# EAGLE design Raspberry_pi_b_swim (EAGLE 6.5.0)
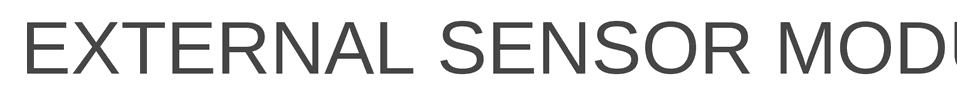
[diagram p0: schematic, sheet 1, part 1 of 2]
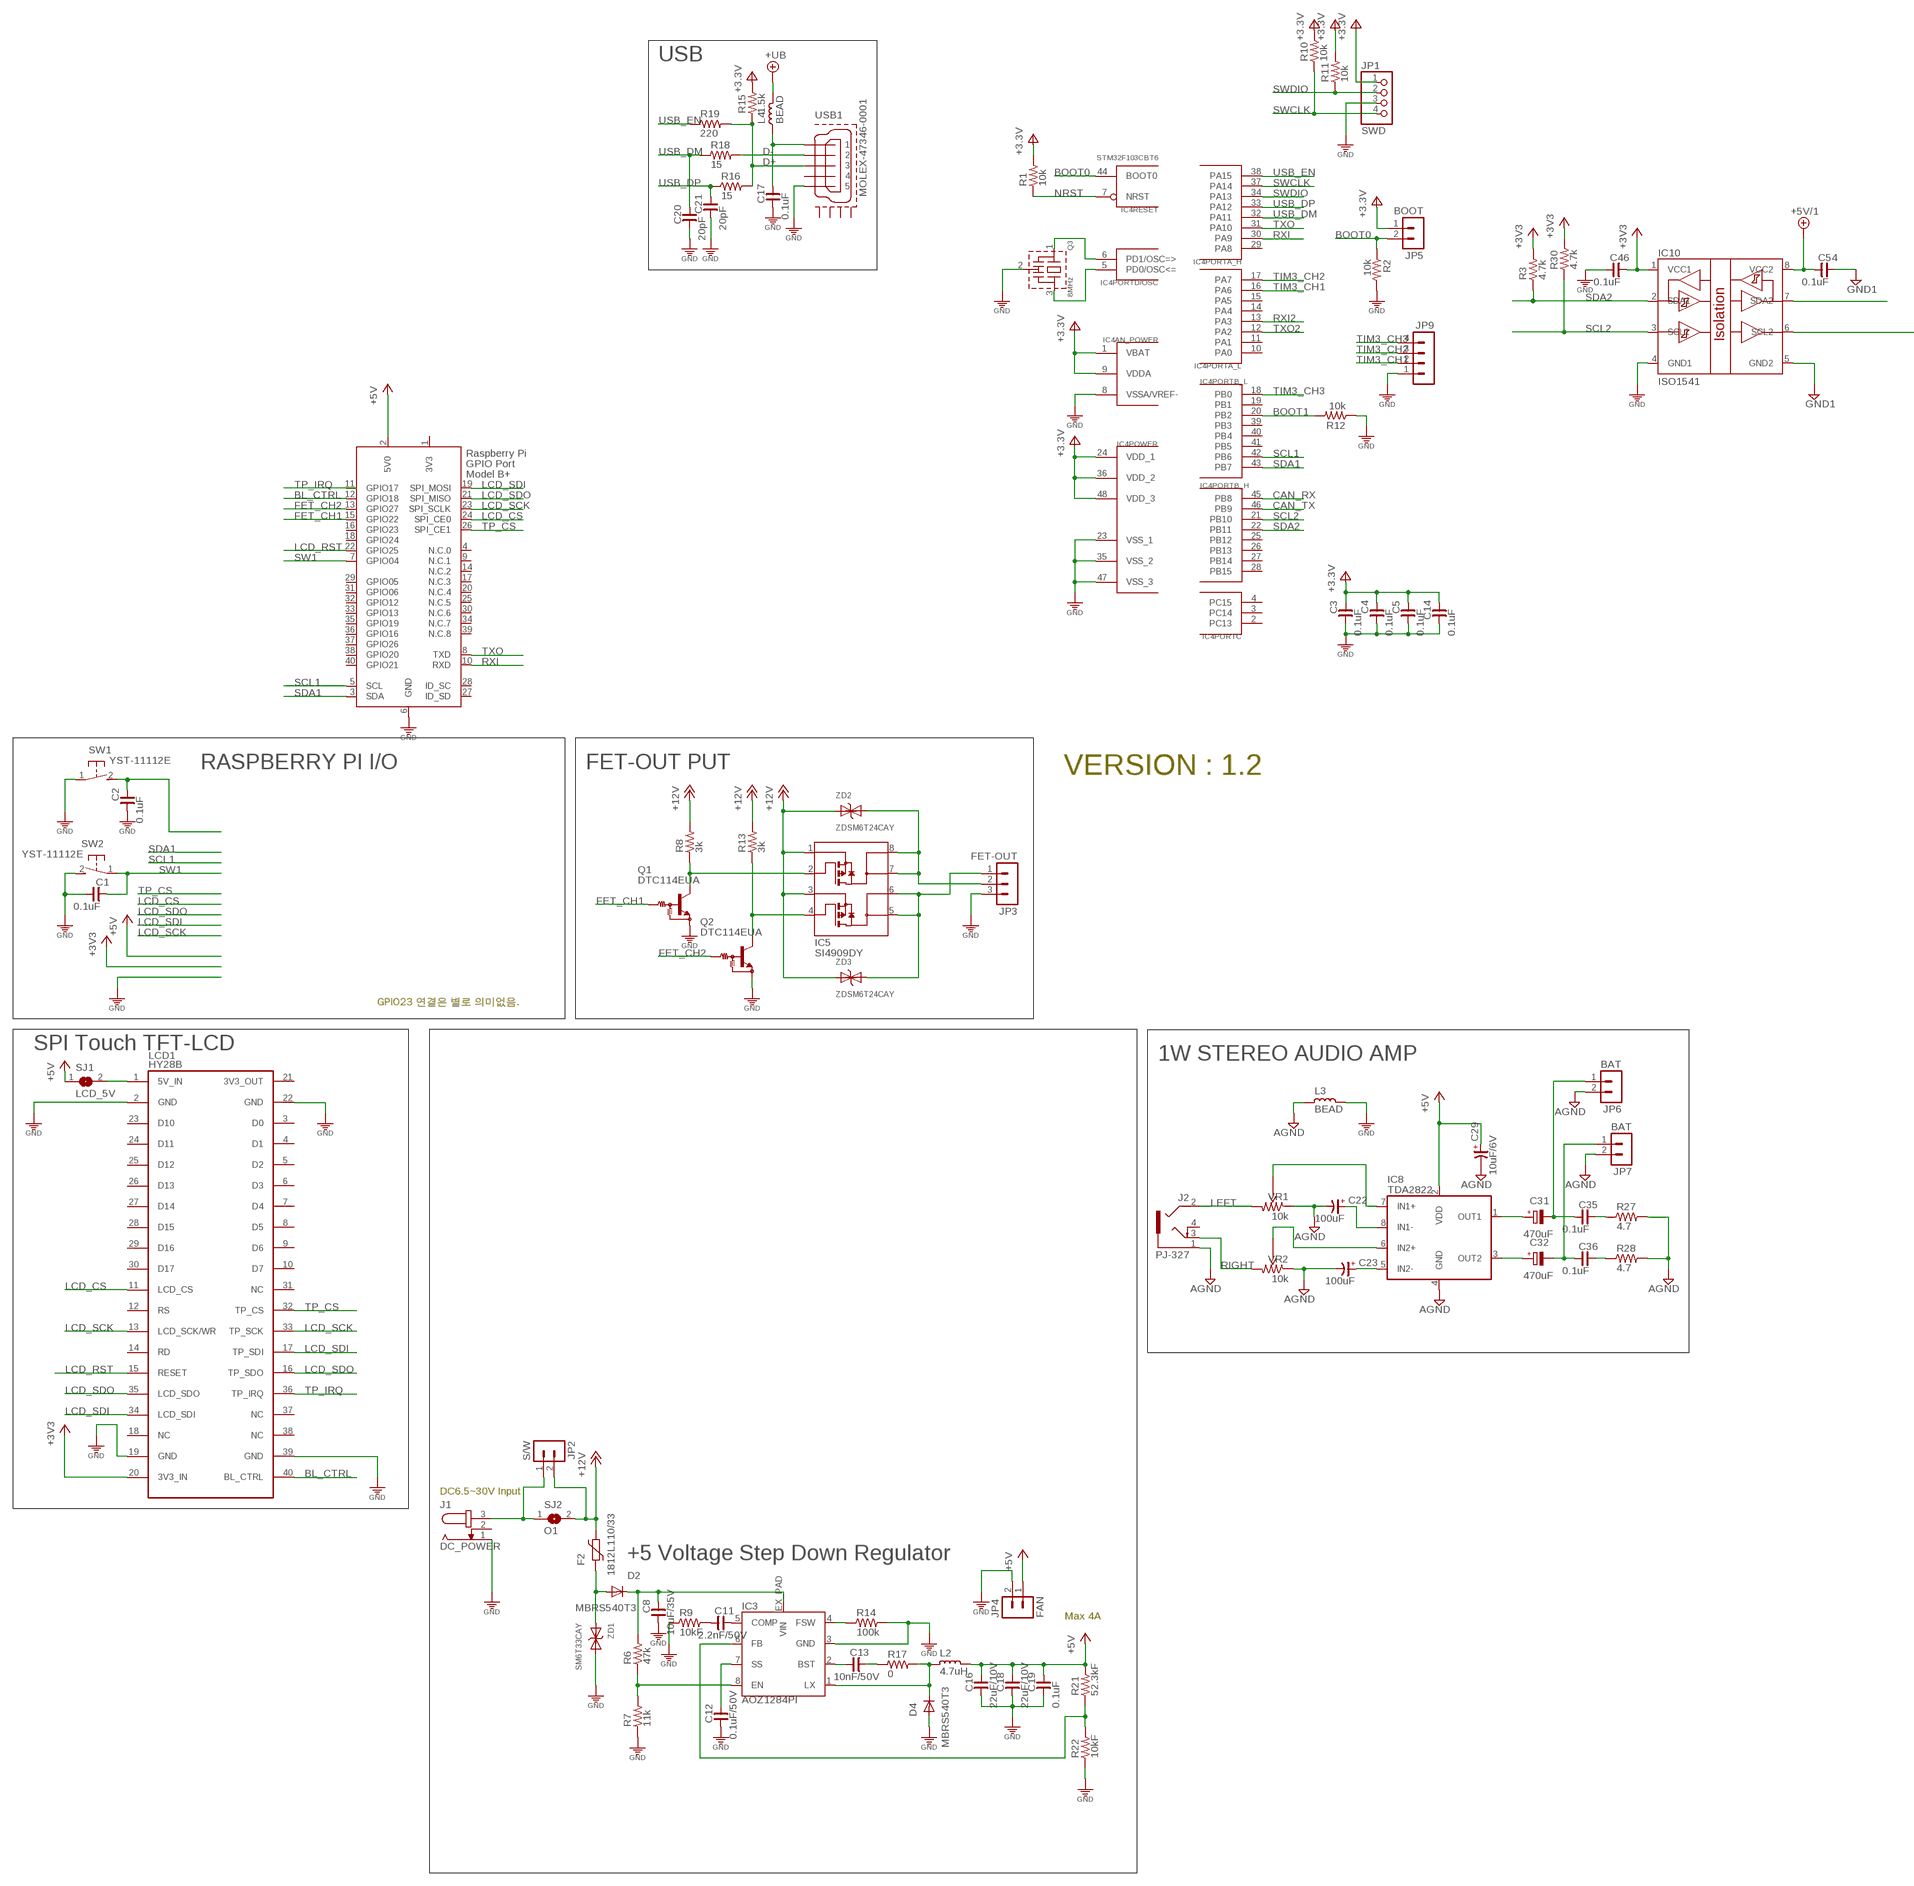
[diagram p1: schematic, sheet 1, part 2 of 2]

## Parts
C1  0.1uF  C_0603  [C0603]
C2  0.1uF  C_0603  [C0603]
C3  0.1uF  C_0603  [C0603]
C4  0.1uF  C_0603  [C0603]
C5  0.1uF  C_0603  [C0603]
C8  10uF/35V  C_3225  [C3225]
C11  2.2nF/50V  C_0603  [C0603]
C12  0.1uF/50V  C_0603  [C0603]
C13  10nF/50V  C_0603  [C0603]
C14  0.1uF  C_0603  [C0603]
C16  22uF/10V  C_3216  [C3216]
C17  0.1uF  C_0603  [C0603]
C18  22uF/10V  C_3216  [C3216]
C19  0.1uF  C_0603  [C0603]
C20  20pF  C_0603  [C0603]
C21  20pF  C_0603  [C0603]
C22  100uF  CP_3528-21  [C3528-21/T]
C23  100uF  CP_3528-21  [C3528-21/T]
C29  10uF/6V  CP_3216-18  [C3216-18/T]
C31  470uF  CPOL-EUD/7343-31W  [D/7343-31W]
C32  470uF  CPOL-EUD/7343-31W  [D/7343-31W]
C35  0.1uF  C_0603  [C0603]
C36  0.1uF  C_0603  [C0603]
C46  0.1uF  C_0603  [C0603]
C54  0.1uF  C_0603  [C0603]
D2  MBRS540T3  DIODE-SMC  [SMC]
D4  MBRS540T3  DIODE-SMC  [SMC]
F2  1812L110/33  1812L  [1812L]
IC3  AOZ1284PI  [S08-EP1]
IC4  STM32F103CBT6  STM32F10XCXT6  [TQFP48]
IC5  SI4909DY  P-CH_DUALSO-8  [SO08-1]
IC8  TDA2822  [SO08]
IC10  ISO1541  [SO08]
J1  DC_POWER  JACK-PLUG0  [SPC4077]
J2  PJ-327  AUDIO_JACK2  [PJ-327-2]
JP1  SWD  PINHD-1X4M  [1X04M]
JP2  S/W  MA02MOL-R  [MA02-MOL-R]
JP3  FET-OUT  MA03-1DEF  [MA03]
JP4  FAN  MA02MOL-R  [MA02-MOL-R]
JP5  BOOT  MA02SMD  [MA02-1-MOL]
JP6  BAT  MA02MOL-R  [MA02-MOL-R]
JP7  BAT  MA02MOL-R  [MA02-MOL-R]
JP9  MA04-15267  [MOLEX5267-04]
L2  4.7uH  L_4545  [L4545]
L3  BEAD  L_0603  [L0603]
L4  BEAD  L_0805  [L0805]
LCD1  HY28B  [HY28A]
Q1  DTC114EUA  [SC59-BEC]
Q2  DTC114EUA  [SC59-BEC]
Q3  8MHz  X-TAL-SMALLRESONATOR  [CSTLA_X]
R1  10k  R_0603  [R0603]
R2  10k  R_0603  [R0603]
R3  4.7k  R_0603  [R0603]
R6  47k  R_0603  [R0603]
R7  11k  R_0603  [R0603]
R8  3k  R_0603  [R0603]
R9  10kF  R_0603  [R0603]
R10  10k  R_0603  [R0603]
R11  10k  R_0603  [R0603]
R12  10k  R_0603  [R0603]
R13  3k  R_0603  [R0603]
R14  100k  R_0603  [R0603]
R15  1.5k  R_0603  [R0603]
R16  15  R_0603  [R0603]
R17  0  R_0603  [R0603]
R18  15  R_0603  [R0603]
R19  220  R_0603  [R0603]
R21  52.3kF  R_0603  [R0603]
R22  10kF  R_0603  [R0603]
R27  4.7  R_0603  [R0603]
R28  4.7  R_0603  [R0603]
R30  4.7k  R_0603  [R0603]
SJ1  LCD_5V  SJ  [SJ]
SJ2  O1  SJ  [SJ]
SW1  YST-11112E  [YST-1112E]
SW2  YST-11112E  [YST-1112E]
USB1  MOLEX-47346-0001  [MOLEX-47364-0001]
VR1  10k  R-TRIMMER-SMD3313  [R-TRIMMER-3313J]
VR2  10k  R-TRIMMER-SMD3313  [R-TRIMMER-3313J]
X1  RASPI_BOARD_B+_F  [RASPI_BOARD_B+_FULL]
ZD1  SM6T33CAY  ZDSM6T33CAY  [SMB]
ZD2  ZDSM6T24CAY  ZDSM6T33CAY  [SMB]
ZD3  ZDSM6T24CAY  ZDSM6T33CAY  [SMB]

## Nets
3V3: C3.1 C4.1 C5.1 C14.1 IC4.1(AN_POWER:VBAT) IC4.9(AN_POWER:VDDA) IC4.24(POWER:VDD_1) IC4.36(POWER:VDD_2) IC4.48(POWER:VDD_3) JP1.1 JP5.1 R1.2 R10.2 R11.2 R15.2 ; supply symbol labelled +3V3
+3V3: C46.1 IC10.1(VCC1) LCD1.20(3V3_IN) R3.2 R30.2
+5V: C16.1 C18.1 C19.1 C29.+ IC8.2(VDD) JP4.1 L2.1 R21.2 SJ1.1 X1.2(5V0)
+5V/1: C54.2 IC10.8(VCC2)
+12V: F2.P$2 IC5.1 IC5.3 JP2.2 R8.2 R13.2 SJ2.2 ZD2.A ZD3.A
+UB: L4.1
AGND: C22.- C23.- C29.- IC8.4(GND) J2.1 JP6.2 JP7.2 L3.2 R27.2 R28.2 VR1.1 VR2.1
BL_CTRL: LCD1.40(BL_CTRL) X1.12(GPIO18)
BOOT0: IC4.44(RESET:BOOT0) JP5.2 R2.1
BOOT1: IC4.20(PORTB_L:PB2) R12.2
CAN_RX: IC4.45(PORTB_H:PB8)
CAN_TX: IC4.46(PORTB_H:PB9)
D+: R15.1 R16.2 R19.2 USB1.3
D-: R18.2 USB1.2
DC-IN: D2.A F2.P$1 ZD1.A
FET_CH1: Q1.2(IN) X1.15(GPIO22)
FET_CH2: Q2.2(IN) X1.13(GPIO27)
GND [GND]: C1.2 C2.2 C3.2 C4.2 C5.2 C8.2 C12.2 C14.2 C16.2 C17.2 C18.2 C19.2 C20.2 C21.2 C46.2 D4.A IC3.3(GND) IC4.8(AN_POWER:VSSA/VREF-) IC4.23(POWER:VSS_1) IC4.35(POWER:VSS_2) IC4.47(POWER:VSS_3) IC10.4(GND1) J1.1 JP1.3 JP3.3 JP4.2 JP9.1 L3.1 LCD1.2(GND) Q1.1(GND) Q2.1(GND) Q3.2(GND) R2.2 R7.1 R9.1 R12.1 R14.2 R22.1 SW1.1 SW2.2 USB1.5 X1.6(GND) ZD1.C(K)
GND1 [GND]: C54.1 IC10.5(GND2)
GND@1 [GND]: LCD1.19(GND) ; supply symbol labelled GND
GND@2 [GND]: LCD1.22(GND) ; supply symbol labelled GND
GND@3 [GND]: LCD1.39(GND) ; supply symbol labelled GND
LCD_CS: LCD1.11(LCD_CS) X1.24(SPI_CE0)
LCD_RST: LCD1.15(RESET) X1.22(GPIO25)
LCD_SCK: LCD1.13(LCD_SCK/WR) LCD1.33(TP_SCK) X1.23(SPI_SCLK)
LCD_SDI: LCD1.17(TP_SDI) LCD1.34(LCD_SDI) X1.19(SPI_MOSI)
LCD_SDO: LCD1.16(TP_SDO) LCD1.35(LCD_SDO) X1.21(SPI_MISO)
LEFT: J2.2 VR1.3
N$1: IC4.6(PORTD/OSC:PD1/OSC=>) Q3.1(IN)
N$2: C8.1 D2.C IC3.EX_PAD(VIN) R6.2
N$3: IC3.6(FB) R21.1 R22.2
N$4: C13.2 IC3.2(BST)
N$5: J1.3 JP2.1 SJ2.1
N$7: IC4.5(PORTD/OSC:PD0/OSC<=) Q3.3(OUT)
N$8: C13.1 R17.1
N$9: D4.C IC3.1(LX) L2.2 R17.2
N$10: C11.1 IC3.5(COMP)
N$11: C11.2 R9.2
N$13: C2.1 SW1.2
N$19: IC3.8(EN) R6.1 R7.2
N$20: IC5.2 Q1.3(OUT) R8.1
N$21: IC3.4(FSW) R14.1
N$22: C17.1 L4.2 USB1.1
N$24: C12.1 IC3.7(SS)
N$31: IC5.4 Q2.3(OUT) R13.1
N$32: LCD1.1(5V_IN) SJ1.2
N$36: C22.+ IC8.8(IN1-)
N$37: C23.+ IC8.5(IN2-)
N$39: IC8.6(IN2+) VR2.2
N$41: IC8.7(IN1+) VR1.2
N$42: C31.+ IC8.1(OUT1)
N$43: C32.+ IC8.3(OUT2)
N$44: C31.- C35.2 JP6.1
N$45: C32.- C36.2 JP7.1
N$46: C35.1 R27.1
N$47: C36.1 R28.1
NRST: IC4.7(RESET:NRST) R1.1
RELAY1: IC5.5 IC5.6 JP3.1 ZD3.C(K)
RELAY2: IC5.7 IC5.8 JP3.2 ZD2.C(K)
RIGHT: J2.3 VR2.3
RXI: IC4.30(PORTA_H:PA9) X1.10(RXD)
RXI2: IC4.13(PORTA_L:PA3)
SCL1: IC4.42(PORTB_L:PB6) X1.5(SCL)
SCL2: IC4.21(PORTB_H:PB10) IC10.3(SCL1) R30.1
SCL2-2: IC10.6(SCL2)
SDA1: IC4.43(PORTB_L:PB7) X1.3(SDA)
SDA2: IC4.22(PORTB_H:PB11) IC10.2(SDA1) R3.1
SDA2-2: IC10.7(SDA2)
SW1: C1.1 SW2.1 X1.7(GPIO04)
SWCLK: IC4.37(PORTA_H:PA14) JP1.4 R10.1
SWDIO: IC4.34(PORTA_H:PA13) JP1.2 R11.1
TIM3_CH1: IC4.16(PORTA_L:PA6) JP9.2
TIM3_CH2: IC4.17(PORTA_L:PA7) JP9.3
TIM3_CH3: IC4.18(PORTB_L:PB0) JP9.4
TP_CS: LCD1.32(TP_CS) X1.26(SPI_CE1)
TP_IRQ: LCD1.36(TP_IRQ)
TXO: IC4.31(PORTA_H:PA10) X1.8(TXD)
TXO2: IC4.12(PORTA_L:PA2)
USB_DM: C20.1 IC4.32(PORTA_H:PA11) R18.1
USB_DP: C21.1 IC4.33(PORTA_H:PA12) R16.1
USB_EN: IC4.38(PORTA_H:PA15) R19.1
Unconnected: IC4.2(PORTC:PC13) IC4.3(PORTC:PC14) IC4.4(PORTC:PC15) IC4.10(PORTA_L:PA0) IC4.11(PORTA_L:PA1) IC4.14(PORTA_L:PA4) IC4.15(PORTA_L:PA5) IC4.19(PORTB_L:PB1) IC4.25(PORTB_H:PB12) IC4.26(PORTB_H:PB13) IC4.27(PORTB_H:PB14) IC4.28(PORTB_H:PB15) IC4.29(PORTA_H:PA8) IC4.39(PORTB_L:PB3) IC4.40(PORTB_L:PB4) IC4.41(PORTB_L:PB5) J1.2 J2.4 LCD1.3(D0) LCD1.4(D1) LCD1.5(D2) LCD1.6(D3) LCD1.7(D4) LCD1.8(D5) LCD1.9(D6) LCD1.10(D7) LCD1.12(RS) LCD1.14(RD) LCD1.18(NC) LCD1.21(3V3_OUT) LCD1.23(D10) LCD1.24(D11) LCD1.25(D12) LCD1.26(D13) LCD1.27(D14) LCD1.28(D15) LCD1.29(D16) LCD1.30(D17) LCD1.31(NC) LCD1.37(NC) LCD1.38(NC) USB1.4 USB1.GND1 USB1.GND2 USB1.GND3 USB1.GND4 X1.4(N.C.0) X1.9(N.C.1) X1.11(GPIO17) X1.14(N.C.2) X1.16(GPIO23) X1.17(N.C.3) X1.18(GPIO24) X1.20(N.C.4) X1.25(N.C.5) X1.27(ID_SD) X1.28(ID_SC) X1.29(GPIO05) X1.30(N.C.6) X1.31(GPIO06) X1.32(GPIO12) X1.33(GPIO13) X1.34(N.C.7) X1.35(GPIO19) X1.36(GPIO16) X1.37(GPIO26) X1.38(GPIO20) X1.39(N.C.8) X1.40(GPIO21)

## Notes on the sheet
- EXTERNAL SENSOR MODULE
- USB
- RASPBERRY PI I/O | FET-OUT PUT | VERSION : 1.2
- GPIO23 연결은 별로 의미없음.
- SPI Touch TFT-LCD
- 1W STEREO AUDIO AMP
- DC6.5~30V Input
- +5 Voltage Step Down Regulator
- Max 4A

## Power pins joined to a net without a drawn wire
3V3: X1.1(3V3)

## Library data of the parts
C1-C5 C8 C11-C14 C16-C21 C35 C36 C46 C54 = cona_lib:C_: NON-POLARIZED CAP
C22 C23 C29 = rc-master-smd:CP_: POLARIZED CAP
C31 C32 = cona_lib:CPOL-EU: POLARIZED CAPACITOR, European symbol
D2 D4 = diode:DIODE-: DIODE
F2 = ptc-littlefuse:1812L
IC3 = cona_lib:AOZ1284PI
IC4 = stm32:STM32F10XCXT6: ST STM32F101/103 48pin LQFP
IC5 = cona_lib:P-CH_DUAL
IC8 = cona_lib:TDA2822
IC10 = cona_lib:ISO1541
J1 = con-jack:JACK-PLUG: DC POWER JACK Power Jack, DC, Right Angle, Through Hole, Rated 5A at 16VDC, PC Terminals Distributor: Farnell (www.Farnell.de) Drawing: 84N1161.pdf / 84N1162.pdf Manufacturer: SPC Technology (www.spctechnology.com) Type: SPC4077 / SPC 4078
J2 = cona_lib:AUDIO_JACK2
JP1 = pinhead:PINHD-1X4: PIN HEADER
JP2 JP4-JP7 = cona_lib:MA02
JP3 = cona_lib:MA03-1: PIN HEADER
JP9 = cona_lib:MA04-1: PIN HEADER
L2-L4 = cona_lib:L_: INDUCTOR
LCD1 = TFT-LCD:HY28B
Q1 Q2 = cona_lib:DTC114EUA: NPN Bias Resistor Transistor
Q3 = cona_lib:X-TAL-SMALL: Ceramic Resonators MuRata CSTCE08MOOG52A
R1-R3 R6-R19 R21 R22 R27 R28 R30 = cona_lib:R_: RESISTOR
SJ1 SJ2 = cona_lib:SJ: SMD solder JUMPER
SW1 SW2 = switch-tact:YST-11112E
USB1 = usb_con-update:MOLEX-47346-0001: MICRO USB B, BOTTOM MOUNT
VR1 VR2 = cona_lib:R-TRIMMER-SMD: SMD R-TRIMMER
X1 = raspberrypi_bastelstube_v13:RASPI_BOARD_B+: Raspberry Pi GPIO connector with markings for the outer dimensions of the Raspberry Pi board model B+ with different sets of drill holes or mounting pads
ZD1-ZD3 = GRU-EURO6:ZD

## Net classes
0 default: clearance 0.152 mm
1 power: width 0.152 mm
2 GND: width 0.2 mm, clearance 0.152 mm

## Board
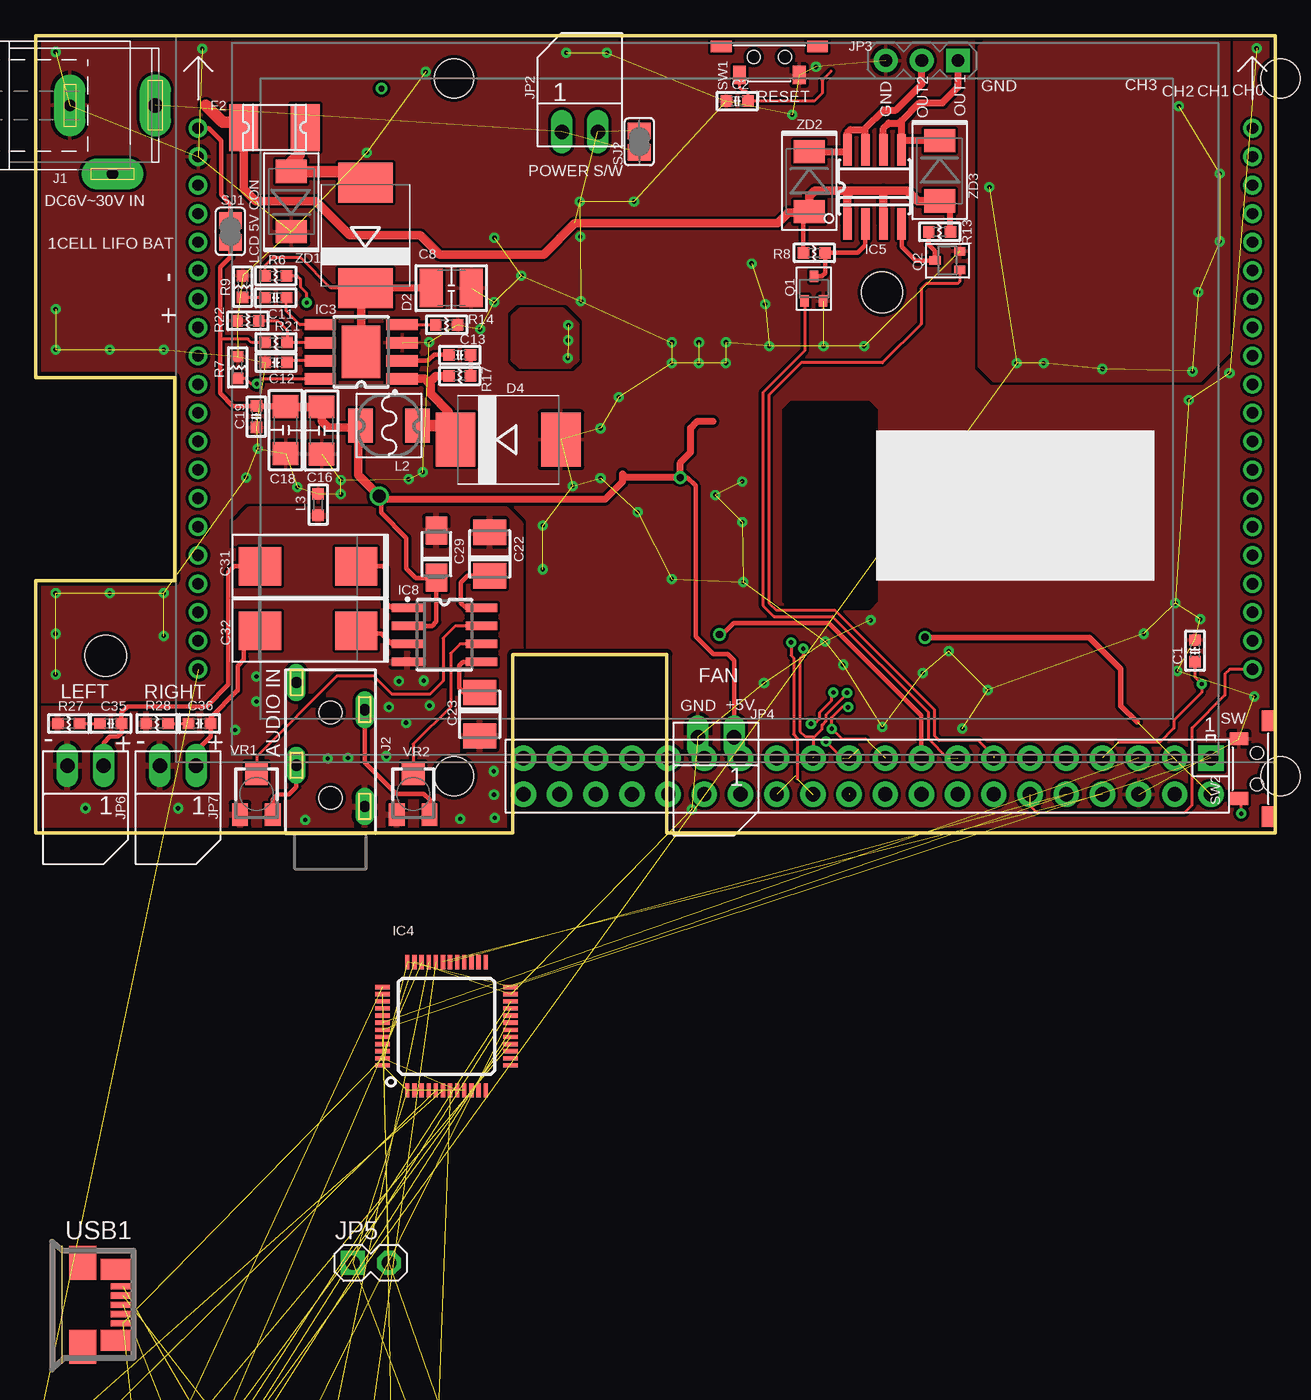
[diagram p2: board, top side]
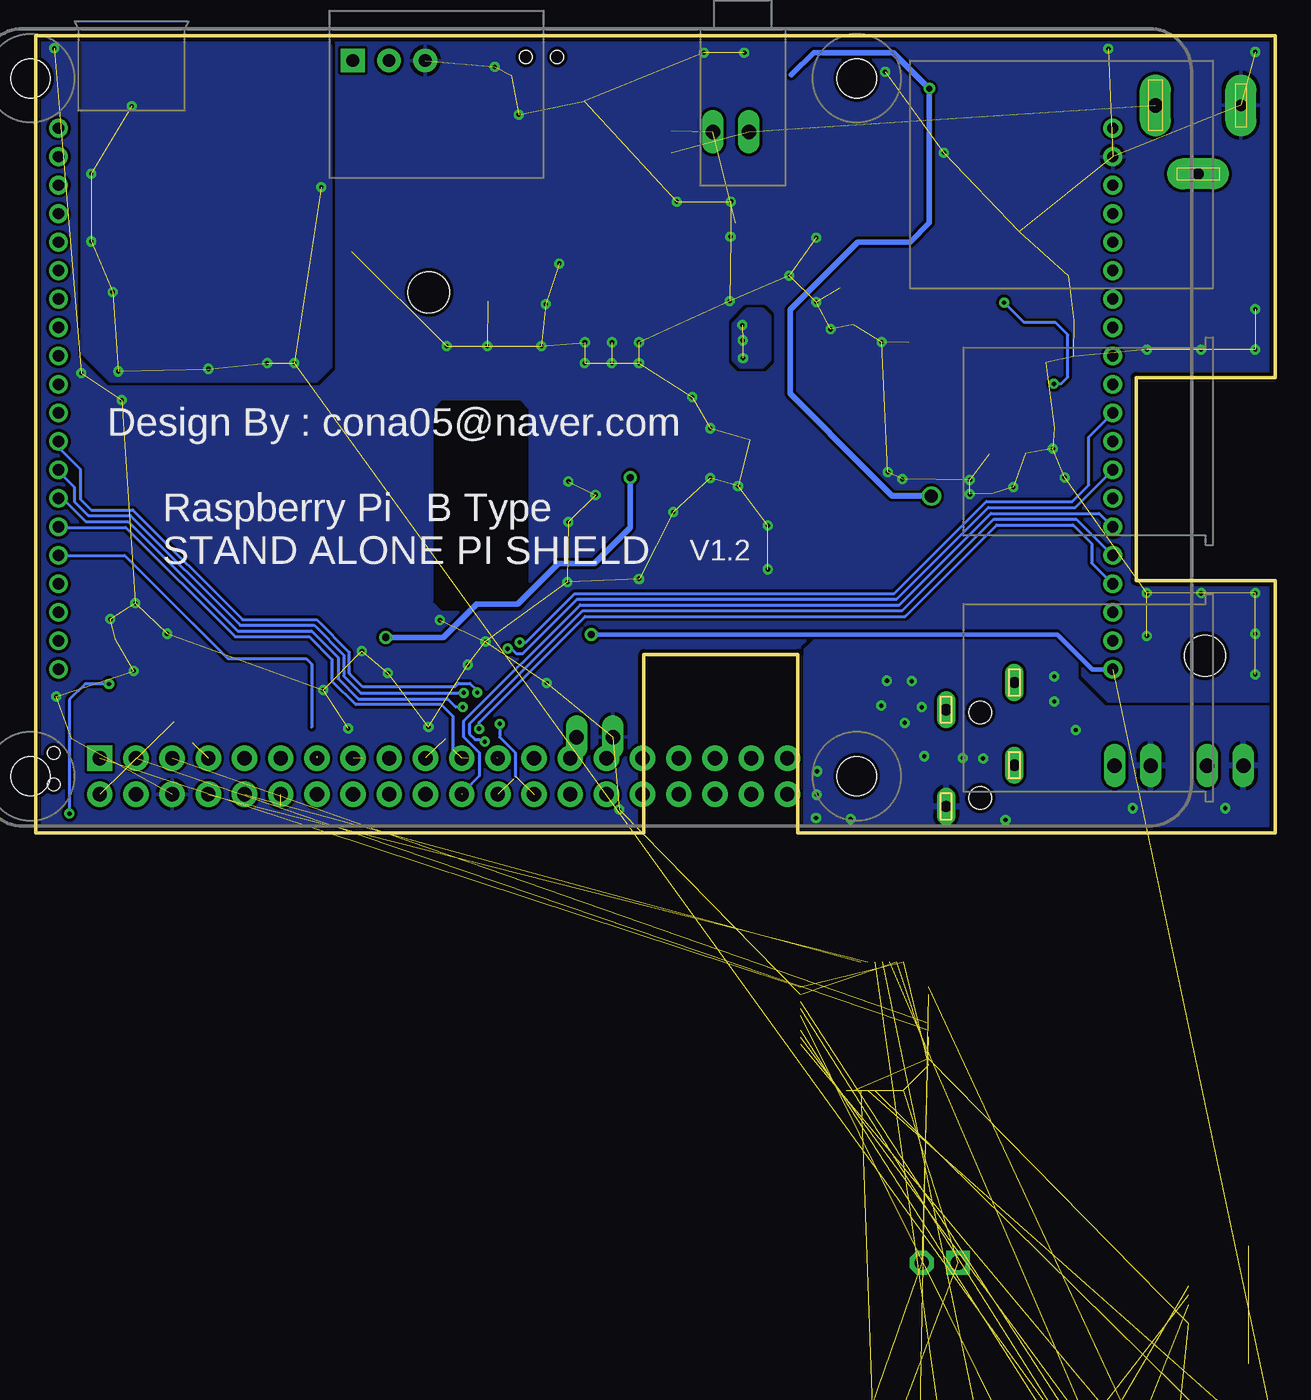
[diagram p3: board, bottom side, seen from below]

Size 87 x 56 mm. Coordinates in mm from the lower left corner, seen from the top.
Outline: 87,56 0,56 0,32 9.75,32 9.75,17.75 0,17.75 0,0 33.5,0 33.5,12.55 44.3,12.55 44.3,0 87,0 87,56
Copper layers (1*16): Top 0.035mm / dielectric 1.5mm / Bottom 0.035mm
Design rules "KHC_mm": minimum track width 0.2mm, minimum drill 0.3mm, track to track 0.2mm, track to pad 0.2mm, pad to pad 0.2mm, via to via 0.2mm, smd to smd 0.2mm, copper to edge 10mil, drill to drill 0.2mm, minimum pad ring 10mil, minimum via ring 8mil, stop-mask expansion 4mil, vias tented up to drill 0mil, thermal gap 10mil
Holes 2.9 mm at 59.4,37.98 4.92,12.45

### Footprints (pad centres in the part's own frame; a part is rotated, then mirrored left to right if it is on the bottom)
C0603 = smd 0.8 x 0.8: 1 -0.762,0; 2 0.762,0
C3225 = smd 1.6 x 2.7: 1 -1.397,0; 2 1.397,0
C3216 = smd 1.6 x 1.8: 1 -1.651,0; 2 1.651,0
C3528-21/T = smd 1.778 x 2.286: + 1.524,0; - -1.524,0
C3216-18/T = smd 1.95 x 1.5: + 1.651,0; - -1.651,0
D/7343-31W = smd 2.95 x 2.7: + 3.375,0; - -3.375,0
SMC = smd 2.8 x 3.8: A 3.7,0; C -3.7,0
1812L = smd 2.03 x 3.3: P$1 -2.16,0; P$2 2.16,0
S08-EP1 = smd 0.8 x 2.2: 1 -1.905,-2.87; 2 -0.635,-2.87; 3 0.635,-2.87; 4 1.905,-2.87; 5 1.905,2.87; 6 0.635,2.87; 7 -0.635,2.87; 8 -1.905,2.87 | smd 3.7 x 2.71: EX_PAD 0,0
TQFP48 = smd 0.3 x 1: 1 -2.75,-4.5; 2 -2.25,-4.5; 3 -1.75,-4.5; 4 -1.25,-4.5; 5 -0.75,-4.5; 6 -0.25,-4.5; 7 0.25,-4.5; 8 0.75,-4.5; 9 1.25,-4.5; 10 1.75,-4.5; 11 2.25,-4.5; 12 2.75,-4.5; 25 2.75,4.5; 26 2.25,4.5; 27 1.75,4.5; 28 1.25,4.5; 29 0.75,4.5; 30 0.25,4.5; 31 -0.25,4.5; 32 -0.75,4.5; 33 -1.25,4.5; 34 -1.75,4.5; 35 -2.25,4.5; 36 -2.75,4.5 | smd 1 x 0.3: 13 4.5,-2.75; 14 4.5,-2.25; 15 4.5,-1.75; 16 4.5,-1.25; 17 4.5,-0.75; 18 4.5,-0.25; 19 4.5,0.25; 20 4.5,0.75; 21 4.5,1.25; 22 4.5,1.75; 23 4.5,2.25; 24 4.5,2.75; 37 -4.5,2.75; 38 -4.5,2.25; 39 -4.5,1.75; 40 -4.5,1.25; 41 -4.5,0.75; 42 -4.5,0.25; 43 -4.5,-0.25; 44 -4.5,-0.75; 45 -4.5,-1.25; 46 -4.5,-1.75; 47 -4.5,-2.25; 48 -4.5,-2.75
SO08-1 = smd 0.6 x 2.2: 1 -1.905,-2.6; 2 -0.635,-2.6; 3 0.635,-2.6; 4 1.905,-2.6; 5 1.905,2.6; 6 0.635,2.6; 7 -0.635,2.6; 8 -1.905,2.6
SO08 = smd 0.6 x 2.2: 1 -1.905,-2.6; 2 -0.635,-2.6; 3 0.635,-2.6; 4 1.905,-2.6; 5 1.905,2.6; 6 0.635,2.6; 7 -0.635,2.6; 8 -1.905,2.6
SPC4077 = drill 0.8 pad 2.184 long: 1 -3,0; 2 0,-4.8 | drill 1 pad 2.184 long: 3 3,0
PJ-327-2 = drill 0.8 long: 1 -2.4,-1.9; 2 2.4,-4.8; 3 -2.4,-8.7; 4 2.4,-10.6 | hole 1.6: 0,-2.5; 0,-8.5
1X04M = drill 0.914 square: 1 -3,0 | drill 0.914: 2 -1,0; 3 1,0; 4 3,0
MA02-MOL-R = drill 1.016 long: 1 -1.27,0; 2 1.27,0
MA03 = drill 0.9 pad 1.676 square: 1 -2.54,0 | drill 0.9 pad 1.676: 2 0,0; 3 2.54,0
MA02-1-MOL = drill 1 pad 1.676 square: 1 -1.27,0 | drill 1 pad 1.676 octagon: 2 1.27,0
MOLEX5267-04 = drill 1 square: 1 -3.81,0 | drill 1: 2 -1.27,0; 3 1.27,0; 4 3.81,0
L4545 = smd 1.7 x 2.4: 1 -2,0; 2 2,0
L0603 = smd 0.8 x 0.8: 1 -0.762,0; 2 0.762,0
L0805 = smd 1.2 x 1.3: 1 -1.016,0; 2 1.016,0
HY28A = drill 0.8: 1 -37,19; 2 -37,17; 3 -37,15; 4 -37,13; 5 -37,11; 6 -37,9; 7 -37,7; 8 -37,5; 9 -37,3; 10 -37,1; 11 -37,-1; 12 -37,-3; 13 -37,-5; 14 -37,-7; 15 -37,-9; 16 -37,-11; 17 -37,-13; 18 -37,-15; 19 -37,-17; 20 -37,-19; 21 37,19; 22 37,17; 23 37,15; 24 37,13; 25 37,11; 26 37,9; 27 37,7; 28 37,5; 29 37,3; 30 37,1; 31 37,-1; 32 37,-3; 33 37,-5; 34 37,-7; 35 37,-9; 36 37,-11; 37 37,-13; 38 37,-15; 39 37,-17; 40 37,-19
SC59-BEC = smd 0.6 x 0.8: 1 0.65,-0.863; 2 -0.65,-0.863; 3 0,0.863
CSTLA_X = smd 0.4 x 2: 1 -1.19,-0.02; 2 0.01,-0.02; 3 1.21,-0.02
R0603 = smd 0.8 x 0.8: 1 -0.762,0; 2 0.762,0
SJ = smd 1.168 x 1.6: 1 -0.762,0; 2 0.762,0
YST-1112E = smd 0.9 x 1.3: 1 -2.1,1.025; 2 2.1,1.025 | smd 1.45 x 0.8: SH -3.375,-1; SH@1 3.375,-1 | hole 0.9: 1.1,-0.25; -1.1,-0.25
MOLEX-47364-0001 = smd 1.7 x 0.45: 1 2.8,1.3; 2 2.8,0.65; 3 2.8,0; 4 2.8,-0.65; 5 2.8,-1.3 | smd 1.9 x 2.375: GND1 0,2.95; GND4 0,-2.95 | smd 2.1 x 1.475: GND2 2.3,2.5; GND3 2.3,-2.5
R-TRIMMER-3313J = smd 1.1 x 1.6: 1 -1.15,-1.45; 3 1.15,-1.45 | smd 1.6 x 1.6: 2 0,1.45
RASPI_BOARD_B+_FULL = drill 1 pad 1.778 square: 1 8.37,51.23 | drill 1 pad 1.778: 2 8.37,53.77; 3 10.91,51.23; 4 10.91,53.77; 5 13.45,51.23; 6 13.45,53.77; 7 15.99,51.23; 8 15.99,53.77; 9 18.53,51.23; 10 18.53,53.77; 11 21.07,51.23; 12 21.07,53.77; 13 23.61,51.23; 14 23.61,53.77; 15 26.15,51.23; 16 26.15,53.77; 17 28.69,51.23; 18 28.69,53.77; 19 31.23,51.23; 20 31.23,53.77; 21 33.77,51.23; 22 33.77,53.77; 23 36.31,51.23; 24 36.31,53.77; 25 38.85,51.23; 26 38.85,53.77; 27 41.39,51.23; 28 41.39,53.77; 29 43.93,51.23; 30 43.93,53.77; 31 46.47,51.23; 32 46.47,53.77; 33 49.01,51.23; 34 49.01,53.77; 35 51.55,51.23; 36 51.55,53.77; 37 54.09,51.23; 38 54.09,53.77; 39 56.63,51.23; 40 56.63,53.77 | hole 2.75: 3.5,3.5; 3.5,52.5; 61.5,3.5; 61.5,52.5
SMB = smd 1.62 x 2.18: A 2.11,0; C -2.11,0

### Placement (x,y rotation side)
C1  81.38,12.8 90 top
C2  49.25,51.4 180 top
C3  29.5,-54.32 0 top  (outside the outline)
C4  33.03,-54.32 0 top  (outside the outline)
C5  -5.81,-58.54 0 top  (outside the outline)
C8  29.18,38.27 0 top
C11  16.85,37.6 180 top
C12  16.88,33.05 180 top
C13  29.77,33.58 180 top
C14  1.25,-58.54 0 top  (outside the outline)
C16  20.07,28.27 270 top
C17  8.32,-58.54 0 top  (outside the outline)
C18  17.55,28.3 270 top
C19  15.5,29.25 270 top
C20  11.85,-58.54 0 top  (outside the outline)
C21  15.38,-58.54 0 top  (outside the outline)
C22  31.88,19.6 270 top
C23  31.18,8.35 90 top
C29  28.12,19.6 270 top
C31  19.12,18.75 0 top
C32  19.12,14.23 0 top
C35  5.27,7.7 0 top
C36  11.5,7.7 0 top
C46  1.25,-73.7 0 top  (outside the outline)
C54  -5.81,-77.92 0 top  (outside the outline)
D2  23.15,41.98 90 top
D4  33.17,27.62 0 top
F2  16.77,49.55 180 top
IC3  22.85,33.8 90 top
IC4  28.84,-13.56 0 top  (outside the outline)
IC5  58.88,45.38 0 top
IC8  28.7,13.92 270 top
IC10  -4.05,-67.94 0 top  (outside the outline)
J1  5.4,51.1 0 top
J2  20.7,-0.02 180 top
JP1  -1.49,-62.6 0 top  (outside the outline)
JP2  38.2,49.25 0 top
JP3  62.2,54.25 180 top
JP4  47.75,6.75 180 top
JP5  23.53,-30.17 0 top  (outside the outline)
JP6  3.5,4.75 180 top
JP7  10,4.75 180 top
JP9  10.83,-43.22 0 top  (outside the outline)
L2  24.8,28.62 0 top
L3  19.82,23.08 270 top
L4  15.35,-49.4 0 top  (outside the outline)
LCD1  48.4,30.5 0 top
Q1  54.62,38.23 0 top
Q2  64,40.2 90 top
Q3  0.85,-43.68 0 top  (outside the outline)
R1  28.71,-49.14 0 top  (outside the outline)
R2  32.24,-49.14 0 top  (outside the outline)
R3  -5.81,-73.93 0 top  (outside the outline)
R6  16.85,39.12 180 top
R7  14.17,32.7 270 top
R8  54.65,40.75 180 top
R9  14.52,38.38 270 top
R10  4.79,-54.55 0 top  (outside the outline)
R11  8.32,-54.55 0 top  (outside the outline)
R12  11.85,-54.55 0 top  (outside the outline)
R13  63.45,42.23 0 top
R14  28.85,35.7 0 top
R15  15.38,-54.55 0 top  (outside the outline)
R16  18.91,-54.55 0 top  (outside the outline)
R17  29.77,32.1 180 top
R18  22.44,-54.55 0 top  (outside the outline)
R19  25.97,-54.55 0 top  (outside the outline)
R21  16.88,34.45 180 top
R22  14.9,35.98 0 top
R27  2.33,7.7 180 top
R28  8.52,7.7 180 top
R30  -2.28,-73.93 0 top  (outside the outline)
SJ1  13.67,42.25 90 top
SJ2  42.38,48.55 90 top
SW1  51.5,54.25 180 top
SW2  85.47,4.52 90 top
USB1  3.31,-33.12 0 top  (outside the outline)
VR1  15.5,2.75 0 top
VR2  26.5,2.75 0 top
X1  90.87,56.5 180 top
ZD1  17.95,44.35 90 top
ZD2  54.3,45.75 270 top
ZD3  63.45,46.5 270 top

### Tracks (layer width: path | path; a pad name or v marks a point on that pad's centre or on a via)
3V3  (15 unrouted)
+3V3  (via drill 0.5)  (4 unrouted)
  Top 0.3: 62.17,5.26 62.17,8.25 55.67,14.75 49,14.75 48.23,13.98 v48,13.95
  Bottom 0.3: v48,13.95 15.3,13.95 12.85,11.5 LCD1.20
+5V  (via drill 0.4, 0.5, 0.9)  (1 unrouted)
  Top 0.2: 15.49,30.02 C19.1 | R21.2 15.15,34.45 14.9,34.7 12.98,34.7 12.95,34.67
  Top 0.3: IC8.2 27.84,14.56 28.12,14.85 C29.+ 28.1,17.92 26.68,17.92 26.02,18.58 26.02,20.73 24.25,22.5 24.25,23.55 v24.12,23.67 | JP4.1 49.02,12.13 48.58,12.58 47.55,12.58 46.33,13.8 46.33,24.4 45.75,24.98 v45.25,24.98 | C19.1 15.49,30 13.85,30 12.95,30.9 12.95,34.67 12.95,39.73 13.67,40.45 SJ1.1
  Top 0.4: 77.31,7.79 76.17,8.92 76.17,11.52 73.95,13.75 v62.42,13.75
  Top 0.406: C18.1 15.56,29.95 C19.1
  Top 0.5: 47.54,28.93 46.45,28.93 45.98,28.45 45.98,26.75 45.25,26.02 v45.25,24.98 41.45,24.98 41.2,25.23 41.2,24.67 39.98,23.45 24.35,23.45 v24.12,23.67
  Top 0.6: C18.1 17.57,29.93 C16.1 20.07,28.95 20.55,28.48 22.65,28.48 | 22.65,28.48 L2.1 | 22.65,28.48 22.65,25.15 v24.12,23.67
  Bottom 0.4: 28.12,24.93 28.48,25.27 34.05,30.85 34.05,36.75 29.3,41.5 25.62,41.5 24.27,42.85 v24.27,52.27 26.8,54.8 32.4,54.8 33.95,53.25 | v62.42,13.75 58.4,13.75 56.05,16.1 53.15,16.1 50.33,18.92 47.8,18.92 45.25,21.48 v45.25,24.98
  Bottom 0.406: v24.12,23.67 26.88,23.67 28.48,25.27
+5V/1  (1 unrouted)
+12V  (2 unrouted)
  Top 0.2: 49.67,42.9 49.75,42.83
  Top 0.3: 53.89,43.23 R8.2
  Top 0.406: R13.2 64.21,43.63 ZD3.A | 53.89,43.23 ZD2.A
  Top 0.6: F2.P$2 14.62,45.21 15.45,44.38 19.65,44.38 22.05,41.98 27,41.98 28.35,40.62 35.65,40.62 37.85,42.83 49.75,42.83 52.08,42.83 52.83,43.58 54.37,43.58 | 54.83,43.64 54.76,43.58 54.37,43.58 | 57.25,45.12 54.7,45.12 54.3,44.73 ZD2.A 54.37,43.58 | 57.25,45.12 59.5,45.12 | 59.5,45.12 61.17,45.12 61.92,44.38 63.44,44.38 ZD3.A | IC5.3 59.51,45.12 59.5,45.12 | IC5.1 56.97,44.84 57.25,45.12
  Top 0.8: 11.95,51.1 13.12,49.92 14.52,49.92 F2.P$2
AGND  (via drill 0.3)
  other vias: 32.17,2.7 29.5,4.75 26,7.75 10,1.75 3.5,1.75 20.5,5.25 14,7.25 15.5,9.25 25.5,10.67 27.25,10.7 15.5,11 32.23,1.08 32.15,4.35 29.8,1 18.93,0.92 21.93,5.27 24.62,5.4 27.65,8.95 24.8,8.85
  pour Top: 0,-0.25 0,8.75 12,8.75 14,10.75 14,21.75 15,22.75 33,22.75 34,21.75 34,-0.3
  pour Bottom: 0,-0.25 0,8.75 12,8.75 14,10.75 14,12.25 15.5,13.75 32,13.75 33.5,12.25 33.5,-0.3
BAT-V  (via drill 0.3)  (2 unrouted)
  other vias: 37.4,35.67 37.38,34.6 37.35,33.35
  pour Top: 34,36.75 37,36.75 38,35.75 38,33.25 37.5,32.75 34,32.75 33.5,33.25 33.5,36.25
  pour Bottom: 36,36.75 37,36.75 38,35.75 38,33.25 37.5,32.75 36,32.75 35.5,33.25 35.5,36.25
BL_CTRL  (1 unrouted)
  Top 0.2: 69.8,1.92 70.28,1.45 80.65,1.45 81.17,1.98 81.17,7.4 83.47,9.7 83.47,11.17 83.8,11.5 LCD1.40
BOOT0  (2 unrouted)
BOOT1  (1 unrouted)
D+  (3 unrouted)
D-  (1 unrouted)
DC-IN
  Top 0.2: 18.86,48.39 18.5,48.75
  Top 0.8: F2.P$1 18.5,49.12 18.5,48.75 18.5,47.65 17.95,47.1 ZD1.A 22.36,46.46 D2.A
FET_CH1  (1 unrouted)
  Top 0.2: 64.03,5.25 62.67,6.6 62.67,8.48 55.92,15.23 51.83,15.23 51.05,16 51.05,30.95 53.98,33.88 Q1.2
FET_CH2  (1 unrouted)
  Top 0.2: 67.26,5.41 66.17,6.5 63.42,6.5 63.1,6.83 63.1,8.65 56.1,15.65 52,15.65 51.48,16.17 51.48,30.77 52.02,31.32 52.2,31.5 53.73,33.02 59.42,33.02 62.15,35.75 62.15,38.23 62.52,38.6 64.72,38.6 64.86,38.74 Q2.2
GND  (via drill 0.3, 0.33)  (117 unrouted)
  other vias: 46.55,34.45 46.55,33 48.45,34.45 48.45,33 44.65,34.45 44.65,33 1.4,36.8 1.4,33.95 5.2,33.95 9,33.95 9,16.85 5.2,16.85 1.4,16.85 1.4,14 1.4,11.15 46.05,1.65 35.6,18.52 44.65,17.85 14.77,24.98 65.05,7.35 58.62,14.95 62.27,11.25 59.42,7.45 66.83,10.05 77.78,14 80,16.15 81.75,15.02 80.95,30.4 83.8,32.3 55.3,34.2 51.5,34.2 47.7,23.75 49.6,24.7 49.6,21.85 42.25,22.55 35.6,21.6 26.18,24.85 32.2,37.3 34.1,39.15 38.2,44.35 42,44.35 37.25,54.8 40.1,54.8 1.4,54.85 85.7,55.1 54.77,53.8 53.1,50.45 50.25,40 51.2,37.15 58.15,34.2 38.23,41.88 38.27,37.35 23.25,47.77 27.38,53.45 32.2,41.8 15.6,27 39.65,28.43 40.92,30.62 11.7,55.08 85.55,9.6 51.12,10.55 27.62,34.48 31.2,35.38 18.38,24.3 21.43,24.8 21.43,23.8 39.65,24.93 37.7,24.38 27.18,25.35 9,13.85 56.67,11.83 55.42,13.45 49.67,17.62 64.1,12.77 80.12,11.4
  pour Top (isolate 0.152, rank 2): 87.1,-0.25 0,-0.25 0,56 87.1,56
  pour Bottom (isolate 0.152, rank 2): 87.1,0.7 0,-0.25 0,56 87.1,56
GND1  (via drill 0.3)  (10 unrouted)
  other vias: 83.1,46.3 80.25,51.05 66.95,45.35 83.1,41.55 68.85,33 70.75,33 74.88,32.6 81.2,32.42 81.6,38
  pour Bottom: 67,56 83.75,56 83.75,33.75 81.75,31.75 67.25,31.75 66.25,32.75 66.25,55.25
  pour Top: 67,56 83.75,56 83.75,33.75 81.75,31.75 67.25,31.75 66.25,32.75 66.25,55.25
LCD_CS  (via drill 0.3)  (1 unrouted)
  Top 0.2: 53.45,3.82 53.45,6.7 53.2,6.95 53.2,12.3 53.02,12.48 v53.02,13.4
  Bottom 0.2: LCD1.11 13.08,27.82 13.08,24.45 14.23,23.3 20.27,23.3 26.75,16.83 49.17,16.83 52.6,13.4 v53.02,13.4
LCD_RST  (1 unrouted)
  Bottom 0.2: 57.1,2.77 55.85,4.02 55.85,5.65 56.98,6.77 56.98,7.83 48.77,16.02 26.38,16.02 19.95,22.45 12.35,22.45 LCD1.15
LCD_SCK  (via drill 0.3)  (1 unrouted)
  Top 0.2: v53.88,12.95 53.88,12.48 53.65,12.25 53.65,7.15 54.02,6.77 54.58,6.77 54.62,6.73 | v56.95,9.85 56.95,9.77 55.48,8.3 55.48,7.88 55.2,7.6 55.2,7.3 54.62,6.73 | 54.62,5.31 54.62,6.73
  Bottom 0.2: v56.95,9.85 64.17,9.85 65.38,11.05 65.38,12.52 67.45,14.6 72.65,14.6 80.35,22.3 83.3,22.3 84.28,23.27 84.28,24.3 85.4,25.43 LCD1.33 | LCD1.13 14.02,22.88 20.12,22.88 26.57,16.42 49,16.42 52.8,12.62 53.27,12.62 53.6,12.95 v53.88,12.95
LCD_SDI  (via drill 0.3)  (1 unrouted)
  Top 0.2: 58.27,6.62 56.6,6.62 56.42,6.8 v55.88,7.33 55.88,8.12 56.6,8.85 v57.02,8.85
  Bottom 0.2: LCD1.34 85.1,23.5 83.47,21.88 80.5,21.88 72.83,14.2 67.62,14.2 65.78,12.35 65.78,10.85 64.35,9.42 58.08,9.42 57.5,8.85 v57.02,8.85 | v55.88,7.33 55.88,7.77 48.42,15.23 25.98,15.23 19.55,21.65 14.17,21.65 12.88,20.35 12.88,18.98 LCD1.17
LCD_SDO  (via drill 0.3)  (2 unrouted)
  Top 0.2: 56.65,5.25 v55.48,6.42
  Bottom 0.2: 57.73,5.88 57.73,8.23 58.52,9.02 64.53,9.02 66.2,10.7 66.2,12.2 67.8,13.8 73,13.8 80.67,21.48 85.38,21.48 LCD1.35 | v55.48,6.42 55.3,6.58 56.15,6.58 56.55,6.98 56.55,7.67 48.6,15.62 26.18,15.62 19.75,22.05 13.95,22.05 LCD1.16
LEFT
  Top 0.3: J2.2 18.3,3.25 17.75,2.7 17,2.7 16.65,2.35 VR1.3
N$1  (1 unrouted)
N$2
  Top 0.2: R6.2 16.1,39.85 16.65,40.4 18.6,40.4 20.73,38.27 D2.C 22.85,37.98
  Top 0.5: D2.C 23.62,38.75 24.1,38.27 C8.1
  Top 0.6: IC3.EX_PAD 22.85,37.98
N$3
  Top 0.2: IC3.6 17.65,34.44 R21.1 17.65,34.46 17.65,35.33 17,35.98 R22.2
N$4
  Top 0.3: IC3.2 27.54,33.16 27.98,33.6 28.99,33.6 C13.2
N$5  (2 unrouted)
N$7  (1 unrouted)
N$8
  Top 0.3: C13.1 R17.1
N$9
  Top 0.3: 29.01,28.31 28.9,28.2
  Top 0.6: 29.01,28.31 29.01,29.56 27.73,30.85 27.73,31.48 27.6,31.6 | 27.6,31.6 27.3,31.9 IC3.1 | R17.2 28.1,32.1 27.6,31.6
  Top 0.8: D4.C 28.9,28.2 28.48,28.62 L2.2 26.82,28.65
N$10
  Top 0.2: IC3.5 18.55,35.7 17.6,36.65 17.6,37.59 C11.1
N$11
  Top 0.2: C11.2 14.54,37.6 R9.2
N$13
  Top 0.2: 55.84,53.51 55.2,52.88 55.2,51.95 54.65,51.4 C2.1 50,51.41 50,52 49.88,52.12 49.62,52.12 49.4,52.35 SW1.2
N$18
  cutout Bottom: 53,30.25 58.5,30.25 59,29.75 59,16.25 58.5,15.75 53,15.75 52.5,16.25 52.5,29.75
  cutout Top: 53,30.25 58.5,30.25 59,29.75 59,16.25 58.5,15.75 53,15.75 52.5,16.25 52.5,29.75
N$19  (via drill 0.3)
  Top 0.2: IC3.8 15.87,31.89 v15.52,31.55 15.1,31.55 14.73,31.93 14.19,31.93 R7.2 | v19.02,37.25 19.02,37.92 18.6,38.35 18.6,38.9 18.38,39.12 R6.1
  Bottom 0.2: v15.52,31.55 15.02,31.55 14.55,32.02 14.55,35 15.4,35.85 17.62,35.85 v19.02,37.25
N$20
  Top 0.3: IC5.2 58.24,41.29 57.7,40.75 R8.1 55.41,39.34 55.17,39.1 54.64,39.1 Q1.3
N$21
  Top 0.2: IC3.4 R14.1
N$22  (2 unrouted)
N$24
  Top 0.2: IC3.7 17.75,33.16 C12.1
N$31
  Top 0.3: IC5.4 60.78,41.2 61.77,40.2 Q2.3 63.12,40.21 63.12,40.9 62.69,41.34 R13.1
N$32
  Top 0.3: SJ1.2 13.67,44.17 13.02,44.83 13.02,48.62 12.15,49.5 LCD1.1
N$36
  Top 0.3: C22.+ 30.33,18.08 29.85,17.6 29.85,16.15 30.18,15.83 31.47,15.83 IC8.8
N$37
  Top 0.3: IC8.5 29.97,12.02 29.73,11.77 29.73,10.17 30.02,9.88 31.47,9.88 C23.+
N$39
  Top 0.2: IC8.6 29.79,13.29 29.12,12.62 29.12,8.88 26.5,6.25 VR2.2
N$41
  Top 0.2: IC8.7 29.46,14.56 28.6,13.7 28.6,10.7 27.65,9.75 25.02,9.75 23.75,11.02 21.15,11.02 15.52,5.4 15.52,4.23 VR1.2
N$42
  Top 0.3: IC8.1 24.95,15.83 24.57,16.2 24.57,18.55 24.38,18.75 C31.+
N$43
  Top 0.3: IC8.3 24.98,13.29 24.27,14 22.73,14 C32.+
N$44
  Top 0.3: JP6.1 4.77,6.34 5.2,6.77 5.77,6.77 6.04,7.04 C35.2 6.02,7.71 6.02,8.48 6.45,8.9 12,8.9 13.52,10.42 13.52,18.33 13.95,18.75 C31.-
N$45
  Top 0.3: JP7.1 11.27,5.77 12.27,6.77 12.27,7.69 | 12.27,7.69 C36.2 | 12.27,7.69 12.27,8.12 14.12,9.98 14.15,9.98 14.17,10 14.17,11.75 14.62,12.2 14.62,13.1 C32.-
N$46
  Top 0.2: R27.1 C35.1
N$47
  Top 0.2: R28.1 C36.1
NRST  (1 unrouted)
RELAY1
  Top 0.5: IC5.5 60.78,48.77 | 60.78,48.77 60.78,50.03 | 60.78,50.03 62.02,51.27 63.65,51.27 64.74,52.37 JP3.1 | IC5.6 59.51,49.48 59.88,49.85 60.6,49.85 60.78,50.03 | ZD3.C 60.95,48.61 60.78,48.77
RELAY2
  Top 0.5: IC5.7 58.24,49.49 | 58.24,49.49 59.52,50.77 60.38,50.77 62.2,52.6 JP3.2 | 58.24,49.49 58.15,49.4 57.2,49.4 56.97,49.17 IC5.8 56.86,47.86 ZD2.C
RIGHT
  Top 0.3: J2.3 23.1,4.95 25.3,2.75 27.25,2.75 27.65,2.35 VR2.3
RXI  (1 unrouted)
SCL1  (1 unrouted)
SCL2  (2 unrouted)
SDA1  (1 unrouted)
SDA2  (2 unrouted)
SW1  (via drill 0.3)  (1 unrouted)
  Top 0.2: v84.62,1.38 84.62,2.25 SW2.1 | C1.1 81.38,10.95 v81.85,10.48 81.85,9.88 79.9,7.92 79.9,7.38 78.9,6.38 76,6.38
  Bottom 0.2: v81.85,10.48 83.53,10.48 84.62,9.38 v84.62,1.38
SWCLK  (2 unrouted)
SWDIO  (2 unrouted)
TIM3_CH1  (1 unrouted)
TIM3_CH2  (1 unrouted)
TIM3_CH3  (1 unrouted)
TP_CS  (via drill 0.3)  (1 unrouted)
  Top 0.2: v54.42,7.67 54.67,7.67 55.05,8.05 55.05,8.48 55.88,9.3 55.88,9.75 v56,9.88
  Bottom 0.2: 53.33,4.02 53.33,5.65 54.42,6.75 v54.42,7.67 | LCD1.32 85.4,27.1 83.85,25.55 83.85,23.45 83.1,22.7 80.17,22.7 72.47,15 67.28,15 64.97,12.7 64.97,11.23 64.03,10.27 57.58,10.27 57.33,10.52 56.52,10.52 56,10 v56,9.88
TP_IRQ
  Bottom 0.2: 67.62,7.42 67.62,11.88 68,12.25 73.5,12.25 80.75,19.5 LCD1.36
TXO  (1 unrouted)
USB_DM  (2 unrouted)
USB_DP  (2 unrouted)
USB_EN  (1 unrouted)

### Text on the board
_tplace: OUT1 | GND | OUT2 | GND | CH3 | CH2 | CH1 | CH0 | RESET | POWER S/W | DC6V~30V IN | 1CELL LIFO BAT | - | LCD 5V CON | + | FAN | LEFT | RIGHT | GND | +5V | SW | - | + | - | + | AUDIO IN
_bplace: Design By : cona05@naver.com | Raspberry Pi B Type | V1.2 | STAND ALONE PI SHIELD